# Altium schematic sheet 1V0 Rail.SchDoc
size A
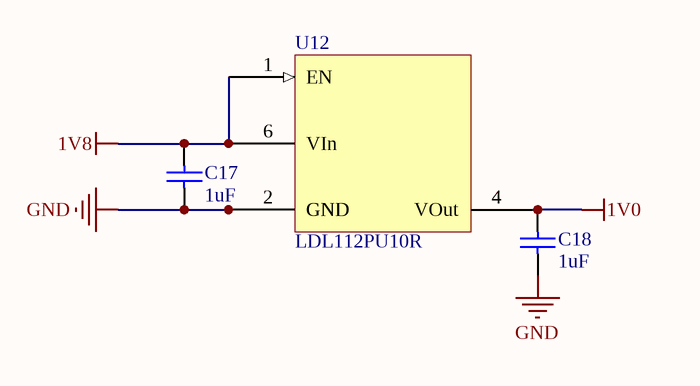
[diagram p0: 1V0 Rail.SchDoc]

## Parts
C17  value 1uF  [1608[0603]]  (hidden comment: Cap)
C18  value 1uF  [1608[0603]]  (hidden comment: Cap)
U12  LDL112PU10R  [LDL112PU10R]

## Nets
1V0: C18.1 U12.4(VOut)
1V8: C17.1 U12.1(EN) U12.6(VIn)
GND: C17.2 C18.2 U12.2(GND) U12.7(GND)

## Library data of the parts
C17 C18 = Cap: Capacitor; Published: 8-Jun-2000; LatestRevisionDate: 17-Jul-2002; LatestRevisionNote: Re-released for DXP Platform.; PackageReference: RAD-0.3; Publisher: Altium Limited; PackageDescription: Radial Cap, Thru-Hole; 2 Leads; 0.3 in Pin Spacing